# EAGLE design H-bridge (EAGLE 6.3)
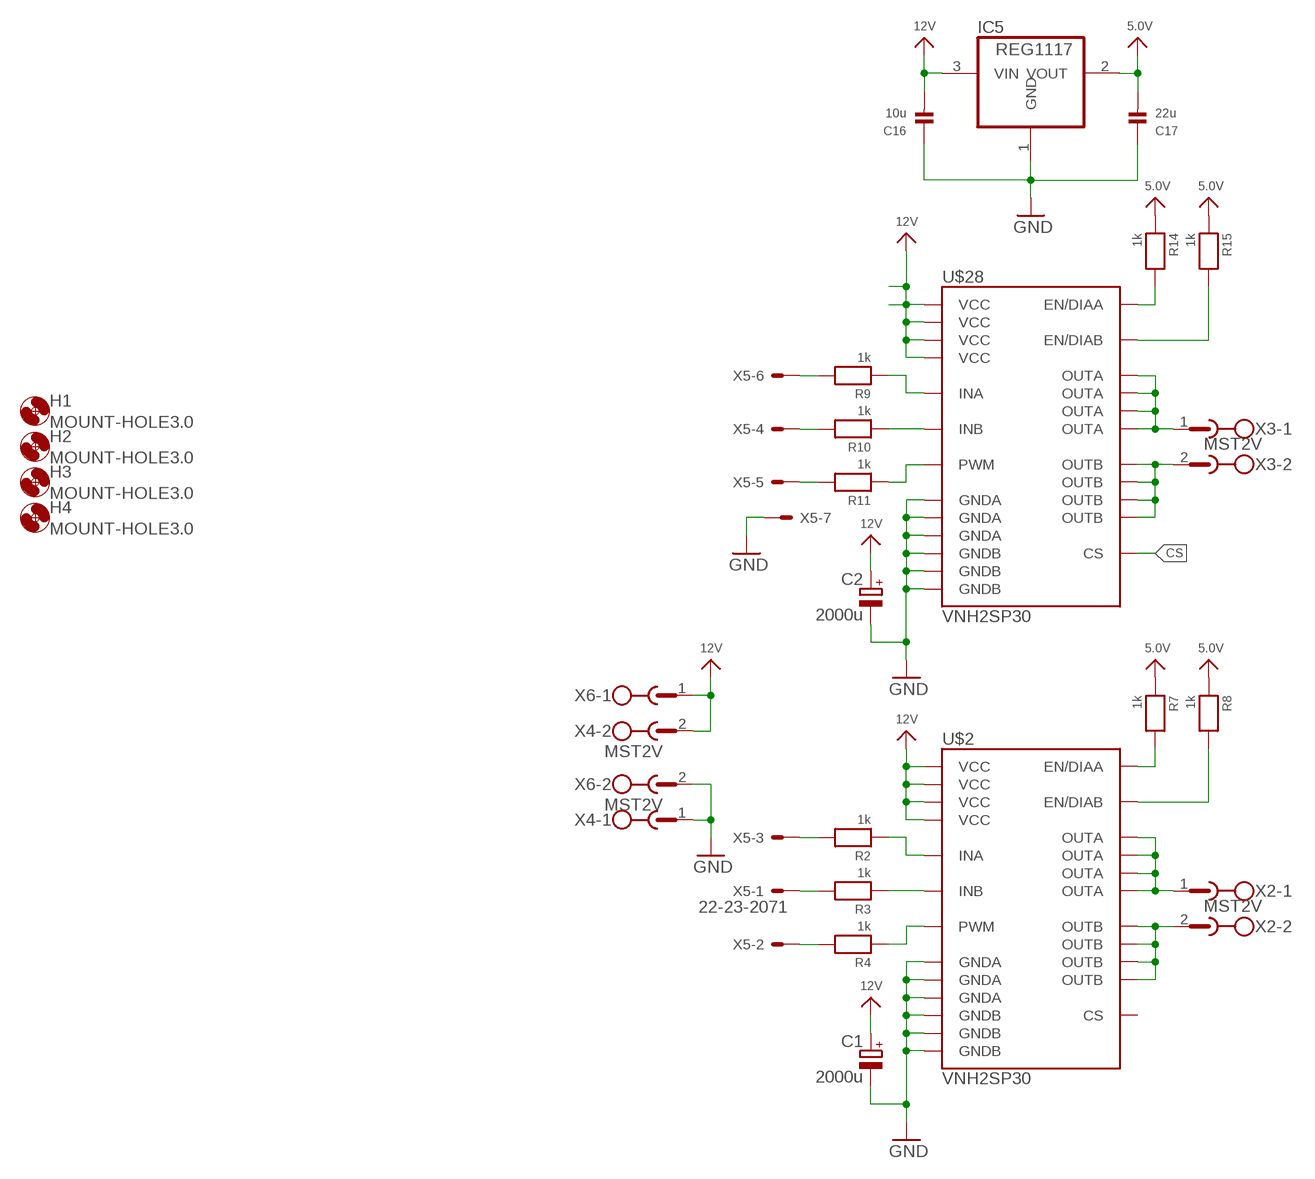
[diagram p0: schematic, sheet 1]

## Parts
C1  2000u  CPOL-EUE10-22.5  [EB22,5D]
C2  2000u  CPOL-EUE10-22.5  [EB22,5D]
C16  10u  CAP_CERAMIC_0805  [_0805]
C17  22u  CAP_CERAMIC_0805  [_0805]
H1  MOUNT-HOLE3.0  [3,0]
H2  MOUNT-HOLE3.0  [3,0]
H3  MOUNT-HOLE3.0  [3,0]
H4  MOUNT-HOLE3.0  [3,0]
IC5  REG1117  [SOT223]
R2  1k  RESISTOR_0603  [_0603]
R3  1k  RESISTOR_0603  [_0603]
R4  1k  RESISTOR_0603  [_0603]
R7  1k  RESISTOR_0603  [_0603]
R8  1k  RESISTOR_0603  [_0603]
R9  1k  RESISTOR_0603  [_0603]
R10  1k  RESISTOR_0603  [_0603]
R11  1k  RESISTOR_0603  [_0603]
R14  1k  RESISTOR_0603  [_0603]
R15  1k  RESISTOR_0603  [_0603]
U$2  VNH2SP30  [VNH2SP30]
U$28  VNH2SP30  [VNH2SP30]
X2  MST2V  [MSTBV2]
X3  MST2V  [MSTBV2]
X4  MST2V  [MSTBV2]
X5  22-23-2071  [22-23-2071]
X6  MST2V  [MSTBV2]

## Nets
5.0V: C17.2 IC5.2(VOUT) R7.1 R8.1 R14.1 R15.1
12V: C1.+ C2.+ C16.2 IC5.3(VIN) U$2.3(VCC) U$2.13(VCC) U$2.23(VCC) U$2.SLUG1(VCC) U$28.3(VCC) U$28.13(VCC) U$28.23(VCC) U$28.SLUG1(VCC) X4.2 X6.1
CS: U$28.9(CS)
CVVM: U$28.15(OUTB) U$28.16(OUTB) U$28.21(OUTB) U$28.SLUG2(OUTB) X3.2
EN1H: R14.2 U$28.6(EN/DIAA)
EN2H: R15.2 U$28.10(EN/DIAB)
GND: C1.- C2.- C16.1 C17.1 IC5.1(GND) U$2.18(GNDB) U$2.19(GNDB) U$2.20(GNDB) U$2.26(GNDA) U$2.27(GNDA) U$2.28(GNDA) U$28.18(GNDB) U$28.19(GNDB) U$28.20(GNDB) U$28.26(GNDA) U$28.27(GNDA) U$28.28(GNDA) X4.1 X5.7 X6.2
N$1: R3.2 X5.1
N$2: R4.2 X5.2
N$3: R7.2 U$2.6(EN/DIAA)
N$4: R8.2 U$2.10(EN/DIAB)
N$5: R2.1 U$2.5(INA)
N$6: R3.1 U$2.11(INB)
N$7: R4.1 U$2.8(PWM)
N$8: R2.2 X5.3
N$9: R10.2 X5.4
N$10: U$2.1(OUTA) U$2.25(OUTA) U$2.30(OUTA) U$2.SLUG3(OUTA) X2.1
N$11: U$2.15(OUTB) U$2.16(OUTB) U$2.21(OUTB) U$2.SLUG2(OUTB) X2.2
N$12: R11.2 X5.5
N$13: R9.2 X5.6
N$28: R11.1 U$28.8(PWM)
N$38: R10.1 U$28.11(INB)
N$39: R9.1 U$28.5(INA)
OUTA: U$28.1(OUTA) U$28.25(OUTA) U$28.30(OUTA) U$28.SLUG3(OUTA) X3.1
Unconnected: U$2.9(CS)

## Library data of the parts
C1 C2 = resistor:CPOL-EU: POLARIZED CAPACITOR, European symbol
C16 C17 = microbuilder:CAP_CERAMIC: Ceramic Capacitors 0402 - 0402 Surface Mount Capacitors 16pF 50V 5% [Digikey: 445-4899-2-ND] 18pF 50V 5% [Digikey: 490-1281-2-ND] 22pF 50V 5% [Digikey: 490-1283-2-ND] 68pF 50V 5% [Digikey: 490-1289-2-ND] 0.1uF 10V 10% [Digikey: 490-1318-2-ND] 1.0uF 6.3V 10% [Digikey: 490-1320-2-ND] 0603 - 0603 Surface Mount Capacitors 16 pF 50V 5% [Digikey: 445-5051-2-ND] 22 pF 50V [Digikey: PCC220ACVTR-ND] 33 pF 50V 5% [Digikey: 490-1415-1-ND] 56pF 50V 5% [Digikey: 490-1421-1-ND] 220pF 50V 5% [Digikey: 445-1285-1-ND] 680 pF 50V 2200 pF 50V 5% C0G [Digikey: 445-1297-1-ND] 5600 pF 100V 5% X7R [Digikey: 478-3711-1-ND] 0.1 µF 25V 10% [Digikey: PCC2277TR-ND] 0.22 µF 16V 10% X7R [Digikey: 445-1318-1-ND] 1.0 µF 25V 10% [Digikey: 445-5146-2-ND] 0603 - RF Specific 3pF 250V +/-0.1pF RF [Digikey: 712-1347-1-ND] 18 pF 250V 5% [Digikey: 478-3505-1-ND or 712-1322-1-ND] 56 pF 250V 5% C0G RF [Digikey: 490-4867-1-ND] 68 pF 250V RF [Digikey: 490-4868-1-ND] 0805 - 0805 Surface Mount Capacitors 220 pF 250V 2% RF Ceramic Capacitor [Digikey: 712-1398-1-ND] 1000 pF 50V 2% NP0 Ceramic Capacitor [Digikey: 478-3760-1-ND] 0.1 µF 25V 10% Ceramic Capacitor [Digikey: PCC1828TR-ND] 1.0 µF 16V 10% Ceramic Capacitor[Digikey: 490-1691-2-ND] 10.0 µF 10V 10% Ceramic Capacitor[Digikey: 709-1228-1-ND] 10.0 uF 16V 10% Ceramic Capacitor [Digikey: 478-5165-2-ND] 47 uF 6.3V 20% Ceramic Capacitor [Digikey: 587-1779-1-ND or 399-5506-1-ND] 1206 - 1206 Surface Mount Capacitors 47uF 10V 20% Ceramic Capacitor [Digikey: 490-5528-1-ND or 399-5508-1-ND or 445-6010-1-ND] 100uF 6.3V -20%, +80% Y5V Ceramic Capacitor (Digikey: 490-4512-1-ND, Mouser: 81-GRM31CF50J107ZE1L)
H1-H4 = holes:MOUNT-HOLE: MOUNTING HOLE with drill center marker
IC5 = burr-brown:REG1117: 800mA and 1A Low Dropout (LDO) Positive Regulator 1.8V, 2.5V, 2.85V, 3.3V, 5V, and Adj; MPN: REG1117; OC_FARNELL: 1097566; OC_NEWARK: 14P6981
R2-R4 R7-R11 R14 R15 = microbuilder:RESISTOR: Resistors 0402 - 0402 Surface Mount Package 22 Ohm 1% 1/16W [Digikey: 311-22.0LRTR-ND] 33 Ohm 5% 1/16W 1.0K 5% 1/16W 1.5K 5% 1/16W 2.0K 1% 1/16W 10.0K 1% 1/16W [Digikey: 311-10.0KLRTR-ND] 10.0K 5% 1/16W [Digikey: RMCF0402JT10K0TR-ND] 12.1K 1% 1/16W [Digikey: 311-22.0LRTR-ND] 100.0K 5% 1/16W 0603 - 0603 Surface Mount Package 0 Ohm 1/10 Watt 1% Resistor 15 Ohm 1/10 Watt 1% Resistor 33 Ohm 1/10 Watt 1% Resistor 49.9 Ohm 1/10 Watt 1% Resistor 100 Ohm 1/10 Watt 1% Resistor 150 Ohm 1/10 Watt 1% Resistor 240 Ohm 1/10 Watt 1% Resistor 390 Ohm 1/10 Watt 1% Resistor 560 Ohm 1/10 Watt 1% Resistor 680 Ohm 1/10 Watt 1% Resistor 750 Ohm 1/10 Watt 1% Resistor 1.0K Ohm 1/10 Watt 1% Resistor 1.5K Ohm 1/10 Watt 1% Resistor 2.0K Ohm 1/10 Watt 1% Resistor 2.2K Ohm 1/10 Watt 1% Resistor 3.3K Ohm 1/10 Watt 1% Resistor 4.7K Ohm 1/10 Watt 1% Resistor 10.0K Ohm 1/10 Watt 1% Resistor 12.0K Ohm 1/10 Watt 1% Resistor 12.1K Ohm 1/10 Watt 1% Resistor 20.0K Ohm 1/10 Watt 1% Resistor 33.0K Ohm 1/10 Watt 1% Resistor 100.0K Ohm 1/10 Watt 1% Resistor 0805 - 0805 Surface Mount Package 0 Ohm 1/8 Watt 1% Resistor 33 Ohm 1/8 Watt 1% Resistor 100 Ohm 1/8 Watt 1% Resistor 150 Ohm 1/8 Watt 1% Resistor 200 Ohm 1/8 Watt 1% Resistor 240 Ohm 1/8 Watt 1% Resistor 330 Ohm 1/8 Watt 1% Resistor 390 Ohm 1/8 Watt 1% Resistor 470 Ohm 1/8 Watt 1% Resistor 1.0K Ohm 1/8 Watt 1% Resistor 1.5K Ohm 1/8 Watt 1% Resistor 2.0K Ohm 1/8 Watt 1% Resistor 4.7K Ohm 1/8 Watt 1% Resistor 5.1K Ohm 1/8 Watt 1% Resistor 5.6K Ohm 1/8 Watt 1% Resistor 10.0K Ohm 1/8 Watt 1% Resistor 22.0K Ohm 1/8 Watt 1% Resistor 33.0K Ohm 1/8 Watt 1% Resistor 100K Ohm 1/8 Watt 1% Resistor 1206 - 1206 Surface Mount Package 2012 - 2010 Surface Mount Package 0.11 Ohm 1/2 Watt 1% Resistor - Digikey: RHM.11UCT-ND
U$2 U$28 = SparkFun-PowerIC:VNH2SP30: 30A motor driver IC
X2-X4 X6 = con-phoenix-508:MST2V: PHOENIX; OC_FARNELL: unknown; OC_NEWARK: unknown
X5 = con-molex:22-23-2071: .100" (2.54mm) Center Header - 7 Pin; MF: MOLEX; MPN: 22-23-2071; OC_FARNELL: 1654534; OC_NEWARK: 56H0445

## Board
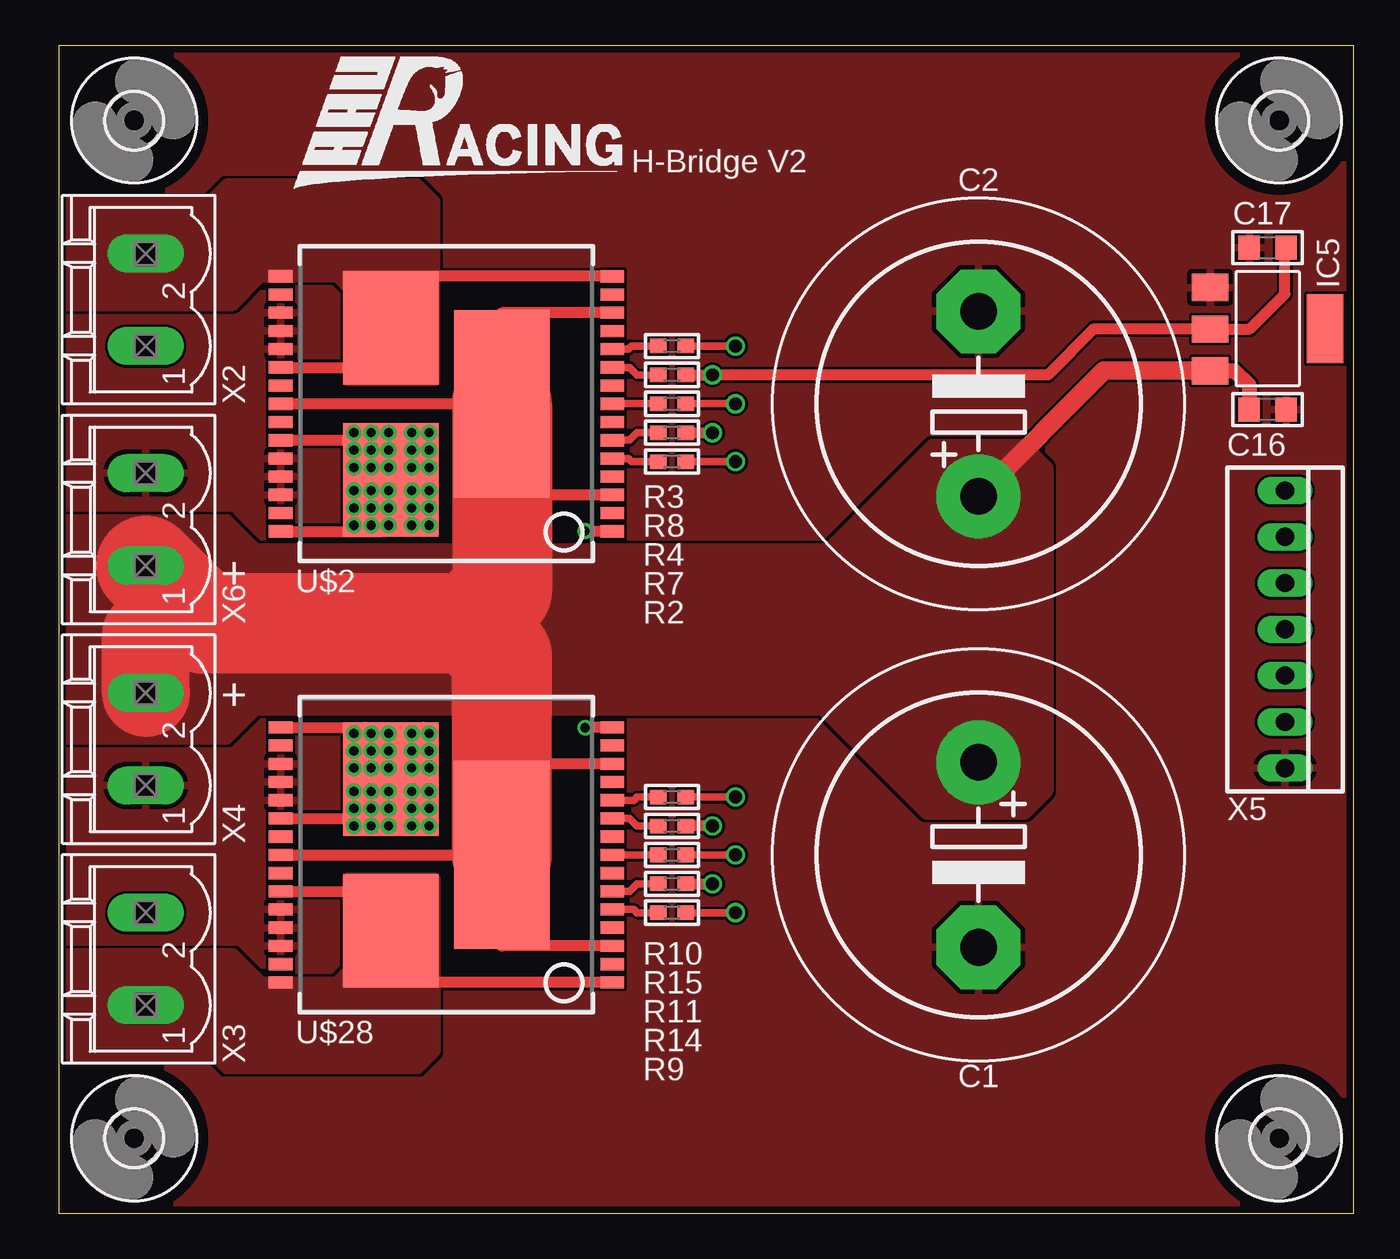
[diagram p1: board, top side]
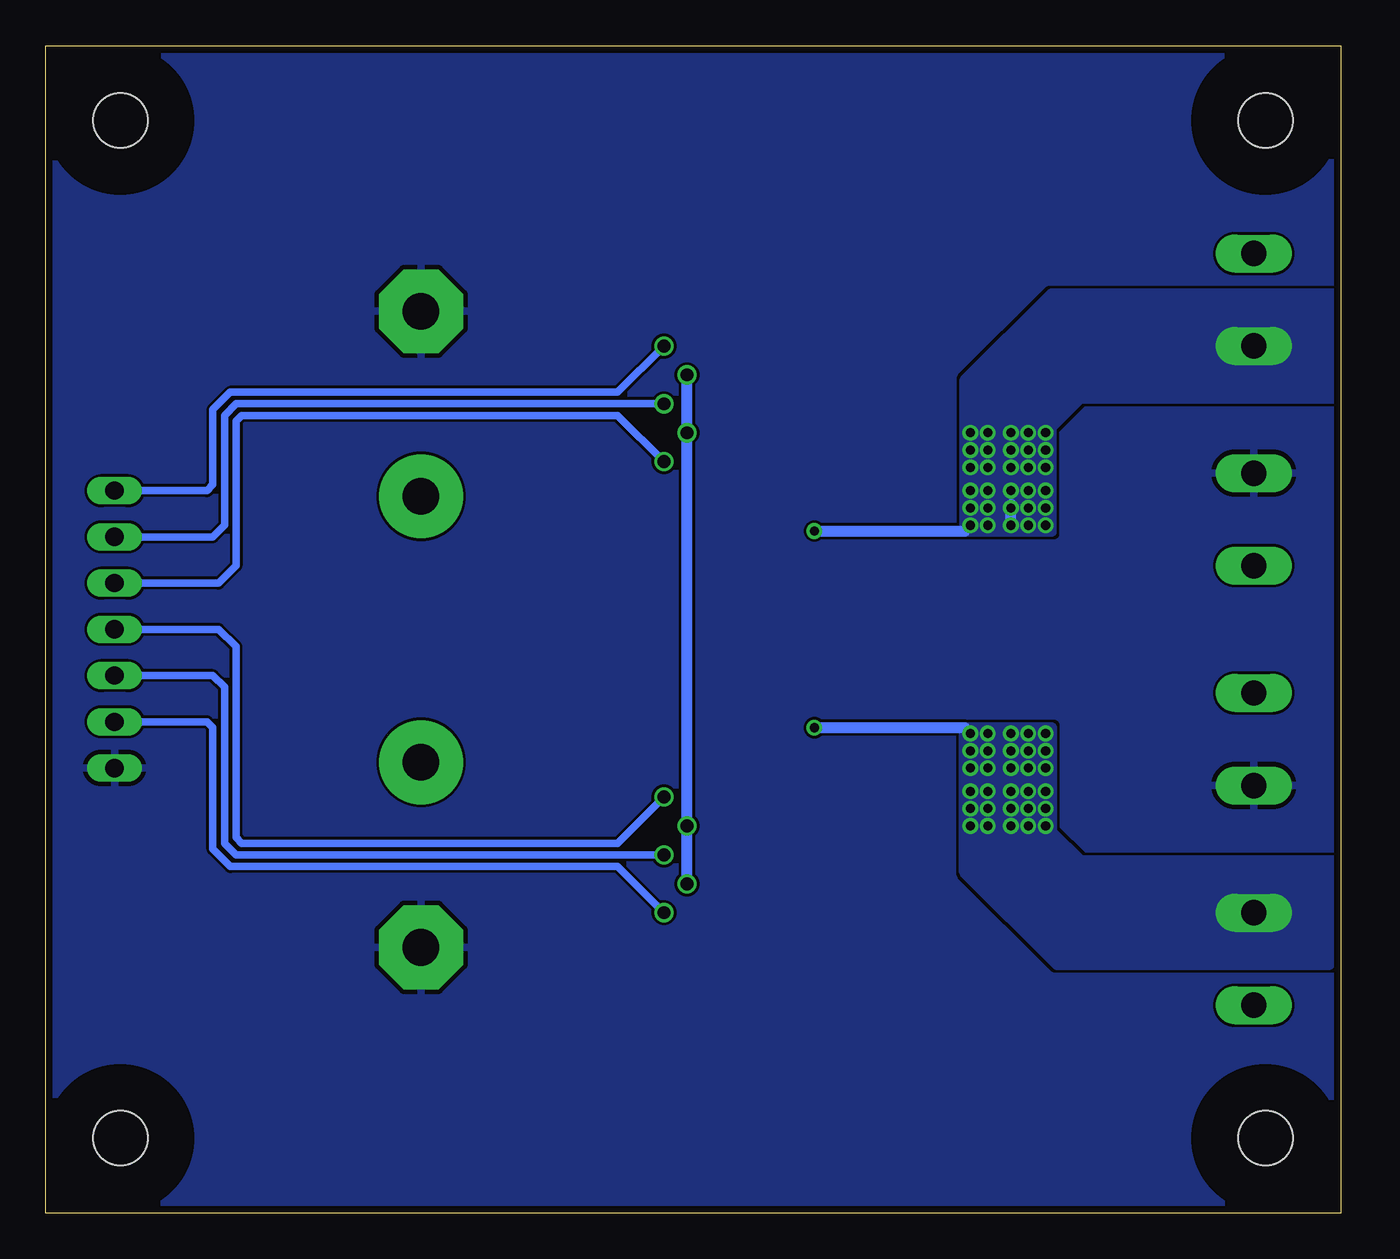
[diagram p2: board, bottom side, seen from below]

Size 71.1 x 64.12 mm. Coordinates in mm from the lower left corner, seen from the top.
Outline: 0,0 71.1,0 71.1,64.12 0,64.12 0,0
Copper layers (1*16): Top 0.0356mm / dielectric 1.5011mm / Bottom 0.0356mm
Design rules "LaenPCBOrder": minimum track width 6mil, minimum drill 13mil, track to track 6mil, track to pad 6mil, pad to pad 6mil, via to via 6mil, smd to smd 6mil, copper to edge 15mil, drill to drill 6mil, minimum pad ring 7mil, minimum via ring 7mil, stop-mask expansion 3mil, vias tented up to drill 0mil, thermal gap 10mil

### Footprints (pad centres in the part's own frame; a part is rotated, then mirrored left to right if it is on the bottom)
EB22,5D = drill 2.007 pad 4.597: + -5.08,0 | drill 2.007 pad 4.597 octagon: - 5.08,0
_0805 = smd 1.2 x 1.3: 1 -1.016,0; 2 1.016,0
3,0 = hole 3: 0,0
SOT223 = smd 1.499 x 2.007: 1 -2.261,-3.15; 2 0.025,-3.15; 3 2.311,-3.15 | smd 3.81 x 2.007: 4 0,3.15
_0603 = smd 0.9 x 0.8: 1 -0.762,0; 2 0.762,0
VNH2SP30 = smd 0.67 x 1.3: 1 -7,-9.1; 2 -6,-9.1; 3 -5,-9.1; 4 -4,-9.1; 5 -3,-9.1; 6 -2,-9.1; 7 -1,-9.1; 8 0,-9.1; 9 1,-9.1; 10 2,-9.1; 11 3,-9.1; 12 4,-9.1; 13 5,-9.1; 14 6,-9.1; 15 7,-9.1; 16 7,9.1; 17 6,9.1; 18 5,9.1; 19 4,9.1; 20 3,9.1; 21 2,9.1; 22 1,9.1; 23 0,9.1; 24 -1,9.1; 25 -2,9.1; 26 -3,9.1; 27 -4,9.1; 28 -5,9.1; 29 -6,9.1; 30 -7,9.1 | smd 10.3 x 5.25: SLUG1 0,-3.05 | smd 6.23 x 5.25: SLUG2 4.165,3.05; SLUG3 -4.165,3.05
MSTBV2 = drill 1.397 long: 1 -2.54,0; 2 2.54,0
22-23-2071 = drill 1 long: 1 -7.62,0; 2 -5.08,0; 3 -2.54,0; 4 0,0; 5 2.54,0; 6 5.08,0; 7 7.62,0

### Placement (x,y rotation side)
C1  50.48,19.68 270 top
C2  50.48,44.45 90 top
C16  66.36,44.13 180 top
C17  66.36,53.02 0 top
H1  4.13,4.13 0 top
H2  4.13,60.01 0 top
H3  66.99,4.13 0 top
H4  66.99,60.01 0 top
IC5  66.36,48.58 270 top
R2  33.66,41.27 0 top
R3  33.66,47.62 0 top
R4  33.66,44.45 0 top
R7  33.66,42.86 180 top
R8  33.66,46.04 180 top
R9  33.66,16.51 0 top
R10  33.66,22.86 0 top
R11  33.66,19.68 0 top
R14  33.66,18.1 180 top
R15  33.66,21.27 180 top
U$2  21.27,44.45 90 top
U$28  21.27,19.68 90 top
X2  4.76,50.16 90 top
X3  4.76,13.97 90 top
X4  4.76,26.04 90 top
X5  67.31,32.07 270 top
X6  4.76,38.1 90 top

### Tracks (layer width: path | path; a pad name or v marks a point on that pad's centre or on a via)
5.0V  (via drill 0.7)
  Top 0.61: R14.1 v35.88,18.1 | v35.88,21.27 R15.1 | R8.1 v35.88,46.04 54.29,46.04 56.83,48.58 63.79,48.58 63.82,48.55 | R7.1 v35.88,42.86 | IC5.2 63.82,48.55 | 63.82,48.55 65.38,48.55 67.31,50.48 67.31,53.02 C17.2
  Bottom 0.61: v35.88,18.1 v35.88,21.27 v35.88,42.86 v35.88,46.04
12V
  Top 0.61: U$2.3 24.45,39.45 | 24.45,39.45 24.32,39.45 | U$2.13 24.32,49.45 U$2.SLUG1 | U$28.3 24.32,14.68 U$28.SLUG1 U$28.23 | U$2.23 U$2.SLUG1 | U$28.13 24.4,24.68 24.32,24.77 | U$2.SLUG1 24.32,39.58 24.45,39.45
  Top 0.813: IC5.3 64.54,46.27 65.34,45.47 C16.2
  Top 1.016: IC5.3 57.38,46.27 C2.+
  Top 4.826: X4.2 4.76,31.75 5.08,32.07
  Top 5.5: U$2.SLUG1 24.32,34.16 22.54,32.38 | 22.54,32.38 7.94,32.38 X6.1 | U$28.SLUG1 24.32,24.77 24.32,30.6 22.54,32.38
  pour Top (no thermals): 0.32,38.1 9.21,38.1 10.8,36.51 42.23,36.51 47.94,42.23 53.02,42.23 54.29,40.96 54.29,23.18 53.02,21.91 47.62,21.91 41.91,27.62 10.8,27.62 9.21,26.04 0.32,26.04
CVVM  (via drill 0.5)
  Top 0.61: U$28.21 16.06,21.68 | 16.06,21.68 U$28.SLUG2 18.1,23.98 18.1,24.77 | U$28.16 16.81,26.68 v18.1,25.4 18.1,24.77 | 20.02,26.68 18.1,24.77 | 16.06,21.68 16.06,21.41 v16.19,21.27 | U$28.15 28.91,26.68 v28.89,26.67
  Bottom 0.61: v28.89,26.67 20.64,26.67 v20.32,26.35
  other vias: 20.32,21.27 16.19,26.35 16.19,25.4 16.19,22.23 16.19,23.18 16.19,24.45 19.37,21.27 17.14,21.27 18.1,21.27 18.1,22.23 18.1,23.18 17.14,23.18 17.14,22.23 17.14,24.45 18.1,24.45 17.14,25.4 17.14,26.35 18.1,26.35 19.37,26.35 19.37,25.4 20.32,25.4 20.32,24.45 19.37,24.45 19.37,22.23 19.37,23.18 20.32,23.18 20.32,22.23
  pour Bottom (no thermals): 0.63,13.65 15.56,13.65 20.64,18.73 20.64,26.67 15.88,26.67 15.88,20.95 14.29,19.37 0.32,19.37 0.32,13.97
EN1H
  Top 0.406: U$28.6 31.34,17.68 31.75,18.1 R14.2
EN2H
  Top 0.406: U$28.10 31.34,21.68 31.75,21.27 R15.2
GND
  pour Bottom (rank 6): 0,0 71.12,0 71.12,64.45 0,64.45
  pour Top (rank 6): 0,0 71.12,0 71.12,64.45 0,64.45
N$1  (via drill 0.7)
  Top 0.406: R3.2 v37.15,47.62
  Bottom 0.406: v37.15,47.62 39.69,45.09 60.96,45.09 61.91,44.13 61.91,40.01 62.23,39.69 X5.1
N$2  (via drill 0.7)
  Top 0.406: R4.2 v37.15,44.45
  Bottom 0.406: v37.15,44.45 60.64,44.45 61.28,43.81 61.28,37.78 61.91,37.15 X5.2
N$3
  Top 0.406: U$2.6 31.34,42.45 31.75,42.86 R7.2
N$4
  Top 0.406: U$2.10 31.34,46.45 31.75,46.04 R8.2
N$5
  Top 0.406: U$2.5 31.26,41.45 31.43,41.27 R2.1
N$6
  Top 0.406: U$2.11 31.26,47.45 31.43,47.62 R3.1
N$7
  Top 0.406: U$2.8 R4.1
N$8  (via drill 0.7)
  Top 0.406: R2.2 v37.15,41.27
  Bottom 0.406: v37.15,41.27 39.69,43.81 60.32,43.81 60.64,43.5 60.64,35.56 61.59,34.61 X5.3
N$9  (via drill 0.7)
  Top 0.406: R10.2 v37.15,22.86
  Bottom 0.406: v37.15,22.86 39.69,20.32 60.32,20.32 60.64,20.64 60.64,31.12 61.59,32.07 X5.4
N$10  (via drill 0.5)
  Top 0.61: U$2.SLUG3 18.22,39.81 v18.1,39.69 | U$2.30 17.77,37.45 v18.1,37.78 | U$2.1 28.91,37.45 v28.89,37.46 | U$2.25 17.56,42.45 v18.1,41.91
  Bottom 0.61: v18.1,37.78 18.1,38.93 | v28.89,37.46 20.64,37.46 v20.32,37.78
  other vias: 16.19,37.78 17.14,37.78 19.37,37.78 18.1,38.73 17.14,38.73 16.19,38.73 16.19,39.69 17.14,39.69 16.19,40.96 17.14,40.96 18.1,40.96 16.19,41.91 17.14,41.91 16.19,42.86 17.14,42.86 18.1,42.86 19.37,38.73 19.37,39.69 20.32,39.69 20.32,38.73 19.37,40.96 20.32,40.96 20.32,41.91 19.37,41.91 19.37,42.86 20.32,42.86
  pour Bottom (no thermals): 0.32,50.48 15.88,50.48 20.64,45.72 20.64,37.46 15.88,37.46 15.88,43.18 14.29,44.77 0.32,44.77
N$11
  Top 0.61: U$2.21 16.06,46.45 U$2.SLUG2 18.1,48.74 18.1,50.48 19.06,51.45 U$2.15
  pour Top (no thermals): 0.32,49.85 9.52,49.85 11.11,51.44 15.24,51.44 15.88,50.8 15.88,45.72 20.64,45.72 20.64,55.56 19.69,56.52 9.21,56.52 8.25,55.56 0.32,55.56
N$12  (via drill 0.7)
  Top 0.406: R11.2 v37.15,19.68
  Bottom 0.406: v37.15,19.68 60.64,19.68 61.28,20.32 61.28,28.89 61.91,29.53 X5.5
N$13  (via drill 0.7)
  Top 0.406: R9.2 v37.15,16.51
  Bottom 0.406: v37.15,16.51 39.69,19.05 60.96,19.05 61.91,20 61.91,26.67 62.23,26.99 X5.6
N$28
  Top 0.406: U$28.8 R11.1
N$38
  Top 0.406: U$28.11 31.57,22.68 31.75,22.86 R10.1
N$39
  Top 0.406: U$28.5 31.57,16.68 31.75,16.51 R9.1
OUTA
  Top 0.61: U$28.1 18.43,12.68 18.41,12.7 18.41,15.33 U$28.SLUG3 16.06,17.68 U$28.25
  pour Top (no thermals): 20.64,18.41 20.64,8.89 19.69,7.94 9.21,7.94 8.57,8.57 0.32,8.57 0.32,14.29 9.52,14.29 11.11,12.7 15.24,12.7 15.88,13.34 15.88,18.41

### Text on the board
tSilk: H-Bridge V2 | + | +